# EAGLE design protoCuantumv2 (1) (EAGLE 9.6.2)
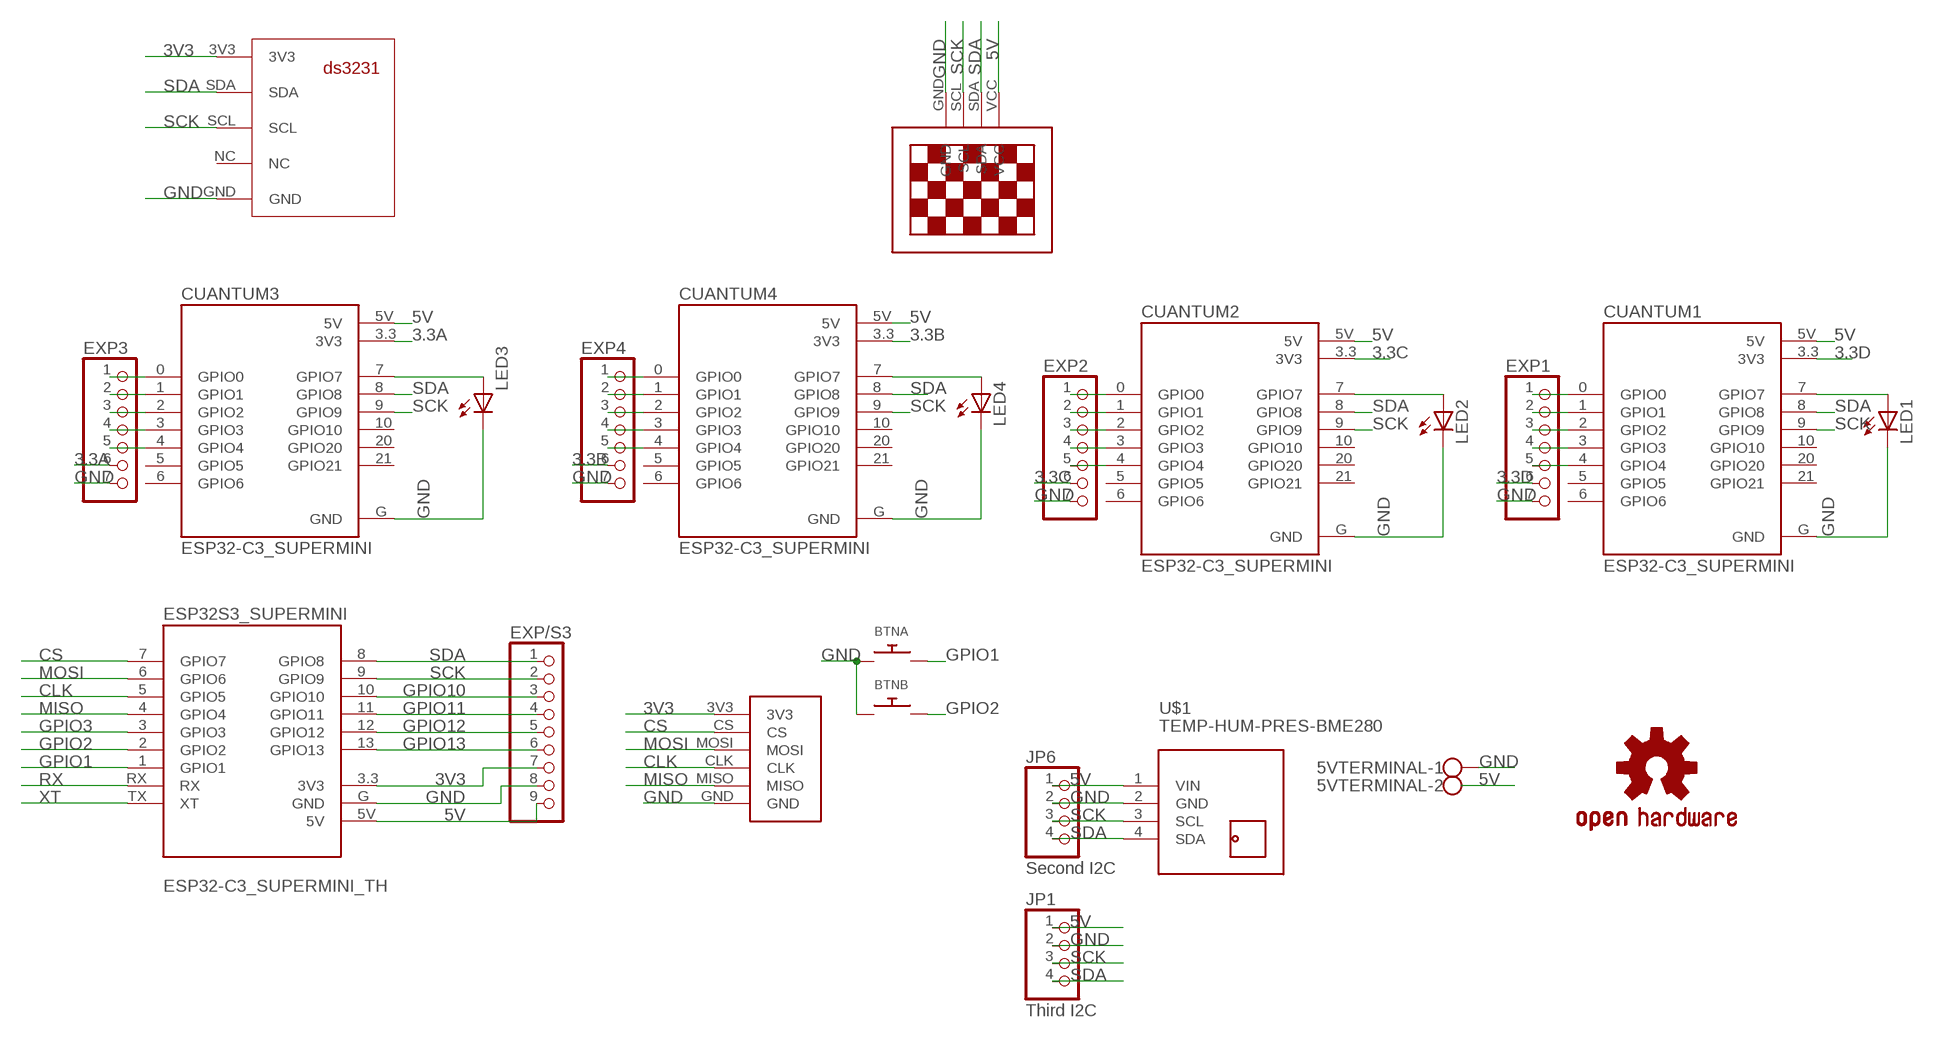
[diagram p0: schematic, sheet 1]

## Parts
5VTERMINAL  W237-102  [W237-102]
BTNA  SWITCH_PUSHBUTTONEVQ-PE  [TACT_PANA-EVQ]
BTNB  SWITCH_PUSHBUTTONEVQ-PE  [TACT_PANA-EVQ]
CUANTUM1  ESP32-C3_SUPERMINI  ESP32-C3_SUPERMINI_TH  [MODULE_ESP32-C3_SUPERMINI_TH]
CUANTUM2  ESP32-C3_SUPERMINI  ESP32-C3_SUPERMINI_TH  [MODULE_ESP32-C3_SUPERMINI_TH]
CUANTUM3  ESP32-C3_SUPERMINI  ESP32-C3_SUPERMINI_TH  [MODULE_ESP32-C3_SUPERMINI_TH]
CUANTUM4  ESP32-C3_SUPERMINI  ESP32-C3_SUPERMINI_TH  [MODULE_ESP32-C3_SUPERMINI_TH]
ESP32S3_SUPERMINI  ESP32-C3_SUPERMINI_TH  [MODULE_ESP32-C3_SUPERMINI_TH]
EXP1  PINHD-1X7  [1X07]
EXP2  PINHD-1X7  [1X07]
EXP3  PINHD-1X7  [1X07]
EXP4  PINHD-1X7  [1X07]
EXP/S3  PINHD-1X9  [1X09]
JP1  Third I2C  PINHD-1X4  [1X04]
JP6  Second I2C  PINHD-1X4  [1X04]
LED1  LED3MM  [LED3MM]
LED2  LED3MM  [LED3MM]
LED3  LED3MM  [LED3MM]
LED4  LED3MM  [LED3MM]
LOGO1  OSHW-LOGOM  [OSHW-LOGO-M]
OLED1.3  13"OLED13"OLED  [1.3"OLED]
U$1  TEMP-HUM-PRES-BME280  [TEMP-HUM-PRES-BME280]
U$2  SD_KUSKALLA  [SD_KUSKALLA]
U$4  RTC  [RTCDS3231FP]

## Nets
3.3A: CUANTUM3.3.3(3V3) EXP3.6
3.3B: CUANTUM4.3.3(3V3) EXP4.6
3.3C: CUANTUM2.3.3(3V3) EXP2.6
3.3D: CUANTUM1.3.3(3V3) EXP1.6
3V3: ESP32S3_SUPERMINI.3.3(3V3) EXP/S3.7 U$2.3V3 U$4.3V3
5V: 5VTERMINAL.2 CUANTUM1.5V CUANTUM2.5V CUANTUM3.5V CUANTUM4.5V ESP32S3_SUPERMINI.5V EXP/S3.9 JP1.1 JP6.1 OLED1.3.VCC U$1.1(VIN)
CLK: ESP32S3_SUPERMINI.5(GPIO5) U$2.CLK
CS: ESP32S3_SUPERMINI.7(GPIO7) U$2.CS
GND: 5VTERMINAL.1 BTNA.P$1 BTNB.P$1 CUANTUM1.G(GND) CUANTUM2.G(GND) CUANTUM3.G(GND) CUANTUM4.G(GND) ESP32S3_SUPERMINI.G(GND) EXP1.7 EXP2.7 EXP3.7 EXP4.7 EXP/S3.8 JP1.2 JP6.2 LED1.K(C) LED2.K(C) LED3.K(C) LED4.K(C) OLED1.3.GND U$1.2(GND) U$2.GND U$4.GND
GPIO1: BTNA.P$2 ESP32S3_SUPERMINI.1(GPIO1)
GPIO2: BTNB.P$2 ESP32S3_SUPERMINI.2(GPIO2)
GPIO3: ESP32S3_SUPERMINI.3(GPIO3)
GPIO10: ESP32S3_SUPERMINI.10(GPIO10) EXP/S3.3
GPIO11: ESP32S3_SUPERMINI.11(GPIO11) EXP/S3.4
GPIO12: ESP32S3_SUPERMINI.12(GPIO12) EXP/S3.5
GPIO13: ESP32S3_SUPERMINI.13(GPIO13) EXP/S3.6
MISO: ESP32S3_SUPERMINI.4(GPIO4) U$2.MISO
MOSI: ESP32S3_SUPERMINI.6(GPIO6) U$2.MOSI
N$1: CUANTUM4.7(GPIO7) LED4.A
N$2: CUANTUM4.0(GPIO0) EXP4.1
N$3: CUANTUM3.7(GPIO7) LED3.A
N$11: CUANTUM1.0(GPIO0) EXP1.1
N$12: CUANTUM1.1(GPIO1) EXP1.2
N$13: CUANTUM2.7(GPIO7) LED2.A
N$14: CUANTUM1.7(GPIO7) LED1.A
N$15: CUANTUM3.0(GPIO0) EXP3.1
N$16: CUANTUM3.1(GPIO1) EXP3.2
N$17: CUANTUM3.2(GPIO2) EXP3.3
N$18: CUANTUM3.3(GPIO3) EXP3.4
N$19: CUANTUM3.4(GPIO4) EXP3.5
N$20: CUANTUM4.1(GPIO1) EXP4.2
N$21: CUANTUM4.2(GPIO2) EXP4.3
N$22: CUANTUM4.3(GPIO3) EXP4.4
N$23: CUANTUM4.4(GPIO4) EXP4.5
N$24: CUANTUM2.0(GPIO0) EXP2.1
N$25: CUANTUM2.1(GPIO1) EXP2.2
N$26: CUANTUM2.2(GPIO2) EXP2.3
N$27: CUANTUM2.3(GPIO3) EXP2.4
N$28: CUANTUM2.4(GPIO4) EXP2.5
N$29: CUANTUM1.2(GPIO2) EXP1.3
N$30: CUANTUM1.3(GPIO3) EXP1.4
N$31: CUANTUM1.4(GPIO4) EXP1.5
RX: ESP32S3_SUPERMINI.RX
SCK: CUANTUM1.9(GPIO9) CUANTUM2.9(GPIO9) CUANTUM3.9(GPIO9) CUANTUM4.9(GPIO9) ESP32S3_SUPERMINI.9(GPIO9) EXP/S3.2 JP1.3 JP6.3 OLED1.3.SCL U$1.3(SCL) U$4.SCL
SDA: CUANTUM1.8(GPIO8) CUANTUM2.8(GPIO8) CUANTUM3.8(GPIO8) CUANTUM4.8(GPIO8) ESP32S3_SUPERMINI.8(GPIO8) EXP/S3.1 JP1.4 JP6.4 OLED1.3.SDA U$1.4(SDA) U$4.SDA
XT: ESP32S3_SUPERMINI.TX(XT)
Unconnected: CUANTUM1.5(GPIO5) CUANTUM1.6(GPIO6) CUANTUM1.10(GPIO10) CUANTUM1.20(GPIO20) CUANTUM1.21(GPIO21) CUANTUM2.5(GPIO5) CUANTUM2.6(GPIO6) CUANTUM2.10(GPIO10) CUANTUM2.20(GPIO20) CUANTUM2.21(GPIO21) CUANTUM3.5(GPIO5) CUANTUM3.6(GPIO6) CUANTUM3.10(GPIO10) CUANTUM3.20(GPIO20) CUANTUM3.21(GPIO21) CUANTUM4.5(GPIO5) CUANTUM4.6(GPIO6) CUANTUM4.10(GPIO10) CUANTUM4.20(GPIO20) CUANTUM4.21(GPIO21) U$4.NC

## Library data of the parts
5VTERMINAL = con-wago-500:W237-102: WAGO SCREW CLAMP; MPN: 237-102; OC_FARNELL: unknown; OC_NEWARK: 70K9898
BTNA BTNB = adafruit:SWITCH_PUSHBUTTON: Buttons SOFTTOUCHSMD_SJ - Soft touch temporary push button (Super Junk Akihabara) Compatible with SKPMANE010 [Mouser: 688-SKPMAN] C&K_KSS = Digikey: KSS221GLFS
CUANTUM1-CUANTUM4 = ESP32-C3_SUPERMINI_TH:ESP32-C3_SUPERMINI_TH: Check availability <https://pricing.snapeda.com/parts/ESP32-C3%20SuperMini_TH/Espressif%20Systems/view-part?ref=eda>; AVAILABILITY: Not in stock; CHECK_PRICES: https://www.snapeda.com/parts/ESP32-C3%20SuperMini_TH/Espressif+Systems/view-part/?ref=eda; DESCRIPTION: Super tiny ESP32-C3 board; MF: Espressif Systems; MP: ESP32-C3 SuperMini_TH; PACKAGE: Package; PRICE: None; SNAPEDA_LINK: https://www.snapeda.com/parts/ESP32-C3%20SuperMini_TH/Espressif+Systems/view-part/?ref=snap
ESP32S3_SUPERMINI = ESP32-S3_SUPERMINI_TH:ESP32-C3_SUPERMINI_TH: Biblioteca modificada para esp32 s3 super mini; AVAILABILITY: Not in stock; DESCRIPTION: Super tiny ESP32-S3; MARCA: model S3 esp32; MF: Espressif Systems; MODEL: esp32 S3; MP: ESP32-S3 SuperMini_TH; PACKAGE: Package
EXP1-EXP4 = pinhead:PINHD-1X7: PIN HEADER
EXP/S3 = pinhead:PINHD-1X9: PIN HEADER
JP1 JP6 = pinhead:PINHD-1X4: PIN HEADER
LED1-LED4 = adafruit:LED: LED OSRAM: - CHIPLED LG R971, LG N971, LY N971, LG Q971, LY Q971, LO R971, LY R971 LH N974, LH R974 LS Q976, LO Q976, LY Q976 LO Q996 - Hyper CHIPLED LW Q18S LB Q993, LB Q99A, LB R99A - SideLED LS A670, LO A670, LY A670, LG A670, LP A670 LB A673, LV A673, LT A673, LW A673 LH A674 LY A675 LS A676, LA A676, LO A676, LY A676, LW A676 LS A679, LY A679, LG A679 - Hyper Micro SIDELED® LS Y876, LA Y876, LO Y876, LY Y876 LT Y87S - SmartLED LW L88C, LW L88S LB L89C, LB L89S, LG L890 LS L89K, LO L89K, LY L89K LS L896, LA L896, LO L896, LY L896 - TOPLED LS T670, LO T670, LY T670, LG T670, LP T670 LSG T670, LSP T670, LSY T670, LOP T670, LYG T670 LG T671, LOG T671, LSG T671 LB T673, LV T673, LT T673, LW T673 LH T674 LS T676, LA T676, LO T676, LY T676, LB T676, LH T676, LSB T676, LW T676 LB T67C, LV T67C, LT T67C, LS T67K, LO T67K, LY T67K, LW E67C LS E67B, LA E67B, LO E67B, LY E67B, LB E67C, LV E67C, LT E67C LW T67C LS T679, LY T679, LG T679 LS T770, LO T770, LY T770, LG T770, LP T770 LB T773, LV T773, LT T773, LW T773 LH T774 LS E675, LA E675, LY E675, LS T675 LS T776, LA T776, LO T776, LY T776, LB T776 LHGB T686 LT T68C, LB T68C - Hyper Mini TOPLED® LB M676 - Mini TOPLED Santana® LG M470 LS M47K, LO M47K, LY M47K Source: http://www.osram.convergy.de/
LOGO1 = SparkFun-Aesthetics:OSHW-LOGO: Open-Source Hardware (OSHW) Logo This logo indicates the piece of hardware it is found on incorporates a OSHW license and/or adheres to the definition of open source hardware found here: http://freedomdefined.org/OSHW
OLED1.3 = 13oled:13"OLED
U$1 = diy-modules:TEMP-HUM-PRES-BME280: Digital Humidity-Temperature-Pressure Sensor based on BME280 device More information about BME280 device is available here: https://www.bosch-sensortec.com/bst/products/all_products/bme280 Click here to find device on ebay.com <http://www.ebay.com/sch/bme280+breakout>
U$2 = SD_KUSKALLA:SD_KUSKALLA
U$4 = rtc for pi ds3231:RTC

## Board
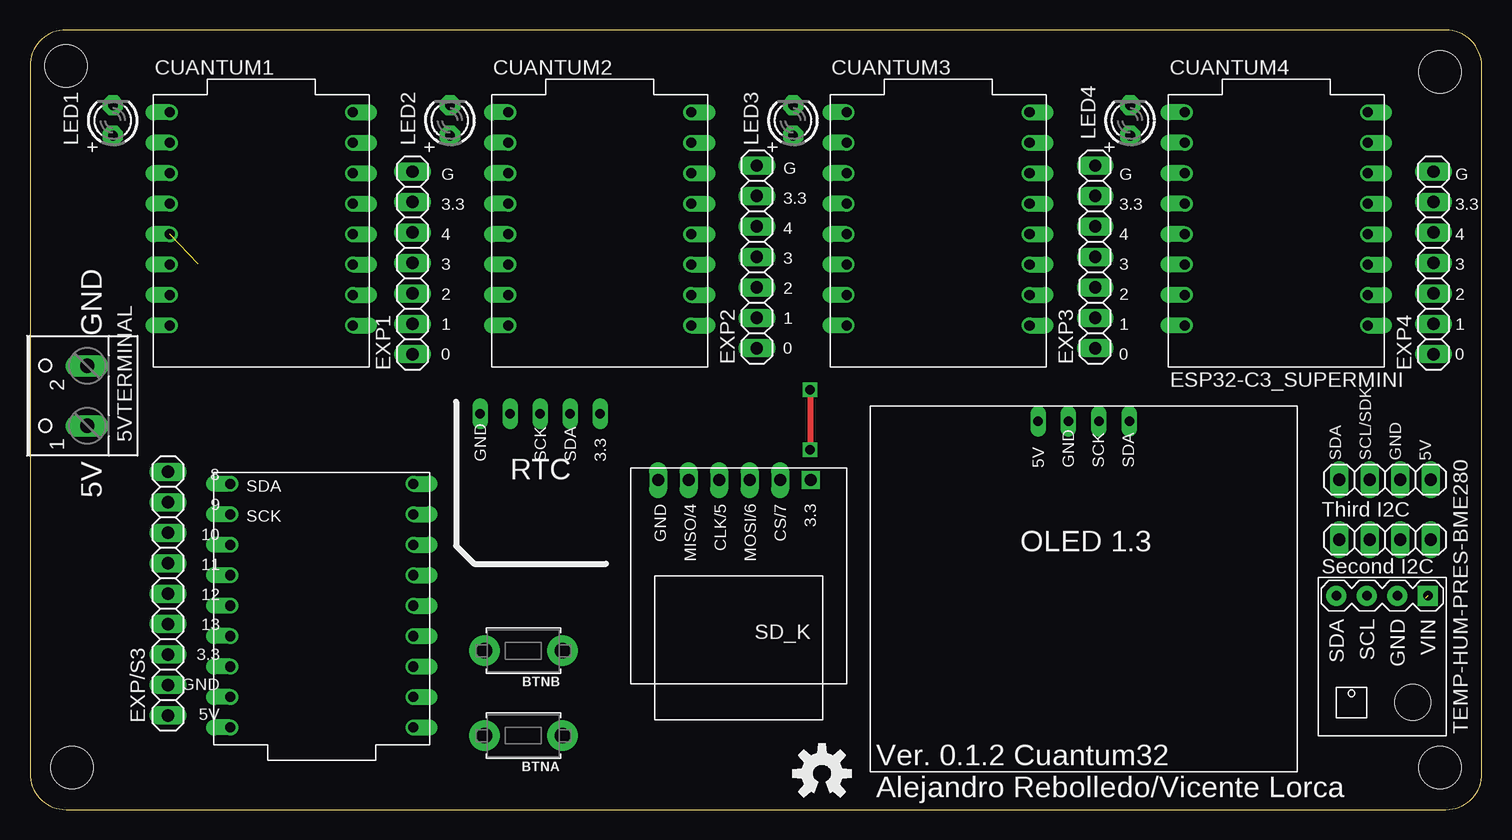
[diagram p1: board, top side]
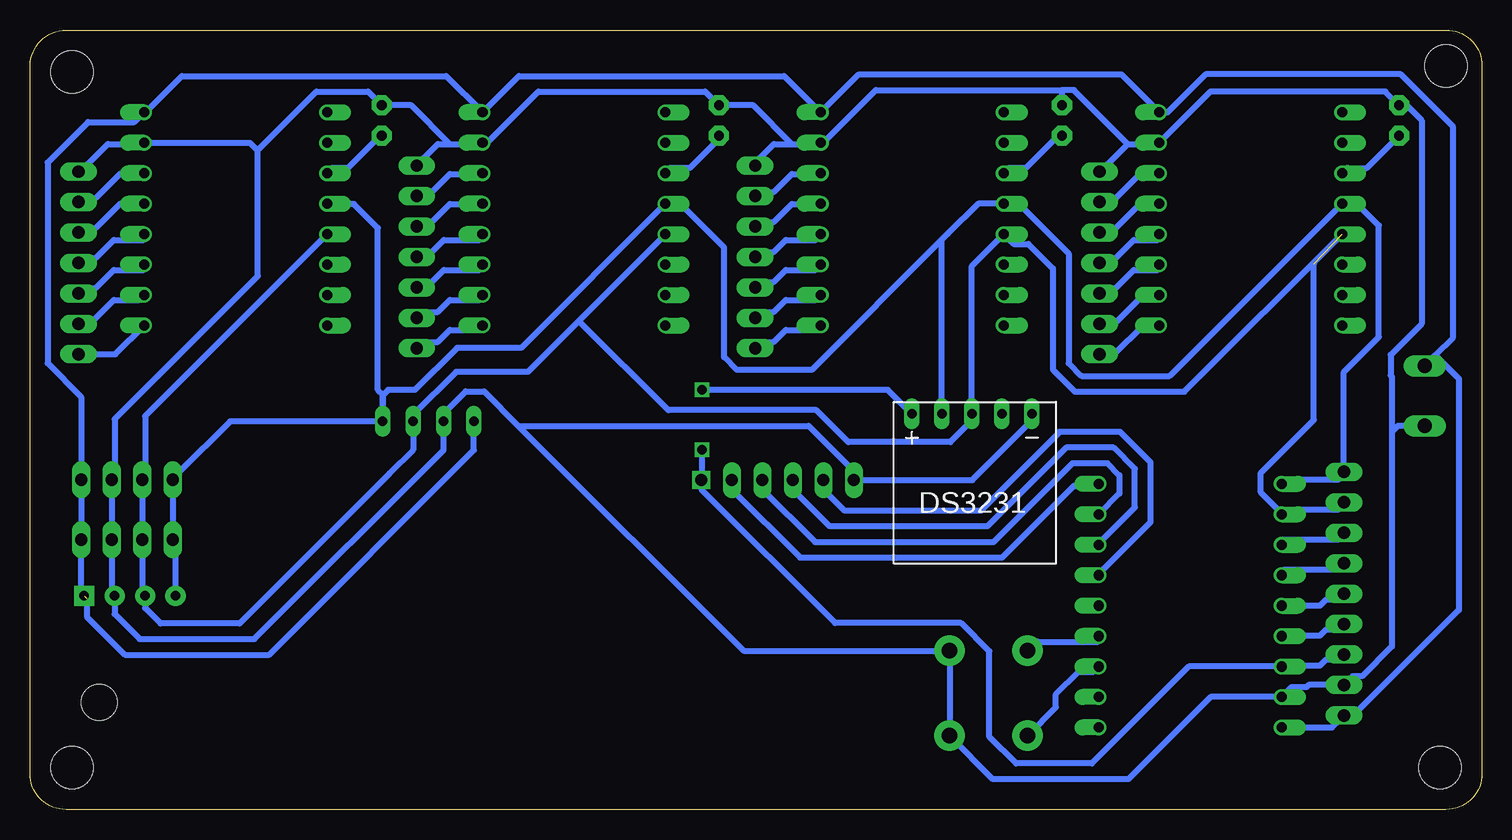
[diagram p2: board, bottom side, seen from below]

Size 121 x 65 mm. Coordinates in mm from the lower left corner, seen from the top.
Outline: 0,62 0,3 arc90 3,0 118,0 arc90 121,3 120.97,62 arc90 117.97,65 3,65 arc90 0,62
Copper layers (1*16): Top 0.035mm / dielectric 1.5mm / Bottom 0.035mm
Design rules "default *": minimum track width 0.5mm, minimum drill 0.8mm, track to track 0.8mm, track to pad 0.8mm, pad to pad 0.8mm, via to via 0.8mm, smd to smd 6mil, copper to edge 40mil, drill to drill 6mil, minimum pad ring 10mil, minimum via ring 8mil, stop-mask expansion 4mil, vias tented up to drill 0mil, thermal gap 10mil
Holes 3.5 mm at 3,62 3.5,3.5 117.5,3.5 117.5,61.5

### Footprints (pad centres in the part's own frame; a part is rotated, then mirrored left to right if it is on the bottom)
W237-102 = drill 1.194 long: 1 -2.5,-1.27; 2 2.5,-1.27
TACT_PANA-EVQ = drill 1.3 pad 2.54: P$1 -3.25,0; P$2 3.25,0
MODULE_ESP32-C3_SUPERMINI_TH = drill 0.84 offset: 0 7.62,-7.88; 1 7.62,-5.34; 2 7.62,-2.8; 3 7.62,-0.26; 3.3 7.62,4.82; 4 7.62,2.28; 5 -7.62,9.9; 5V 7.62,9.9; 6 -7.62,7.36; 7 -7.62,4.82; 8 -7.62,2.28; 9 -7.62,-0.26; 10 -7.62,-2.8; 20 -7.62,-5.34; 21 -7.62,-7.88; G 7.62,7.36
MODULE_ESP32-C3_SUPERMINI_TH' = drill 0.84 offset: 1 -7.62,4.82; 2 -7.62,2.28; 3 -7.62,-0.26; 3.3 7.62,4.82; 4 -7.62,-2.8; 5 -7.62,-5.34; 5V 7.62,9.9; 6 -7.62,-7.88; 7 -7.62,-10.42; 8 7.62,-10.42; 9 7.62,-7.88; 10 7.62,-5.34; 11 7.62,-2.8; 12 7.62,-0.26; 13 7.62,2.28; G 7.62,7.36; RX -7.62,7.36; TX -7.62,9.9
1X07 = drill 1.016 long: 1 -7.62,0; 2 -5.08,0; 3 -2.54,0; 4 0,0; 5 2.54,0; 6 5.08,0; 7 7.62,0
1X09 = drill 1.016 long: 1 -10.16,0; 2 -7.62,0; 3 -5.08,0; 4 -2.54,0; 5 0,0; 6 2.54,0; 7 5.08,0; 8 7.62,0; 9 10.16,0
1X04 = drill 1.016 long: 1 -3.81,0; 2 -1.27,0; 3 1.27,0; 4 3.81,0
LED3MM = drill 0.813 pad 1.676 octagon: A -1.27,0; K 1.27,0
1.3"OLED = drill 0.8 long: GND 2.54,0; SCL 5.08,0; SDA 7.62,0; VCC 0,0
TEMP-HUM-PRES-BME280 = drill 0.8 pad 1.676 square: 1 -5.08,3.81 | drill 0.8 pad 1.676: 2 -5.08,1.27; 3 -5.08,-1.27; 4 -5.08,-3.81 | hole 3: 3.81,2.54
SD_KUSKALLA = drill 1 square: 3V3 -8,6 | drill 1 long: CLK -8,-1.62; CS -8,3.46; GND -8,-6.7; MISO -8,-4.16; MOSI -8,0.92
RTCDS3231FP = drill 0.8 long: 3V3 1,12; GND 1,2; NC 1,4.5; SCL 1,7; SDA 1,9.5

### Placement (x,y rotation side)
5VTERMINAL  3.5,34.5 90 top
BTNA  41.12,6.16 180 top
BTNB  41.12,13.24 180 top
CUANTUM1  19.28,48.24 0 top
CUANTUM2  47.47,48.24 0 top
CUANTUM3  75.67,48.24 0 top
CUANTUM4  103.86,48.24 0 top
ESP32S3_SUPERMINI  ESP32-C3_SUPERMINI_TH  [MODULE_ESP32-C3_SUPERMINI_TH']  24.32,16.74 180 top
EXP1  31.88,45.58 90 top
EXP2  60.57,46.08 90 top
EXP3  88.77,46.08 90 top
EXP4  116.96,45.58 90 top
EXP/S3  11.5,18 270 top
JP1  112.92,27.5 180 top
JP6  112.92,22.5 180 top
LED1  6.91,57.45 90 top
LED2  35,57.45 90 top
LED3  63.59,57.45 90 top
LED4  91.68,57.45 90 top
LOGO1  66,3 0 top
OLED1.3  84,32.37 0 top
U$1  112.68,12.74 270 top
U$2  59.05,19.47 270 top
U$4  35.5,34 270 top

### Tracks (layer width: path | path; a pad name or v marks a point on that pad's centre or on a via)
3.3A
  Bottom 0.5: CUANTUM3.3.3 83.5,53 86,53 87.5,51.5 88.5,51.5 EXP3.6
3.3B
  Bottom 0.5: CUANTUM4.3.3 111.5,53 113.5,53 115.5,51 116.5,51 EXP4.6
3.3C
  Bottom 0.5: CUANTUM2.3.3 55.5,53 57.5,53 59,51.5 60.5,51.5 EXP2.6
3.3D
  Bottom 0.5: CUANTUM1.3.3 27,53 28.5,53 30.5,51 31.5,51 EXP1.6
3V3  (via drill 0.8, 0.8 pad 1.05)
  Top 0.5: v65,35 v65,30
  Bottom 0.5: EXP/S3.7 11.5,12.5 13,12.5 13.5,12 16.5,12 ESP32S3_SUPERMINI.3.3 24.42,11.92 32.5,3.84 38.83,3.84 41.05,6.06 41.05,13.2 43.41,15.56 53.91,15.56 65.05,26.7 U$2.3V3 65,27.47 v65,30 | v65,35 49.5,35 U$4.3V3
5V  (1 unrouted)
  Bottom 0.5: ESP32S3_SUPERMINI.5V 12.5,6.84 11.67,7.67 | 11.67,7.67 EXP/S3.9 | 116.25,17.58 116.25,16.07 113.1,12.92 101.06,12.92 84,29.98 OLED1.3.VCC | 3.88,37.88 2.4,39.37 2.4,56.94 6.76,61.3 23.04,61.3 26.2,58.14 CUANTUM1.5V 30.06,61.3 51.93,61.3 CUANTUM2.5V 55.14,58.14 58.16,61.16 80.27,61.16 CUANTUM3.5V 86.31,61.16 108.34,61.16 111.36,58.14 CUANTUM4.5V 112.3,57.32 116.16,57.32 119.53,53.95 119.53,37.21 116.73,34.41 JP1.1 JP6.1 116.73,18.06 U$1.1 | 3.88,37.88 5VTERMINAL.2 | 3.88,37.88 1.93,35.93 1.93,16.63 10.88,7.67 11.67,7.67
CLK
  Bottom 0.5: ESP32S3_SUPERMINI.5 31.94,22.18 28.92,25.21 28.92,28.41 30.69,30.18 34.65,30.18 41.23,23.61 54.34,23.61 57.43,26.7 U$2.CLK
CS
  Bottom 0.5: ESP32S3_SUPERMINI.7 32.1,27 34,27 39.99,21.01 56.82,21.01 62.51,26.7 U$2.CS
GND
  Bottom 0.5: 29.5,55.5 27,55.5 CUANTUM1.G 22.64,59.86 8.05,59.86 LED1.K 6.28,58.72 5.02,57.47 5.02,40.5 7.61,37.91 7.61,36.19 7.5,36.08 7.5,31.5 | 29.5,55.5 31.5,53.5 EXP1.7 | 35,60 34,60 29.5,55.5 | 57.5,55.5 59,55.5 60.5,54 EXP2.7 | 57.5,55.5 55.5,55.5 CUANTUM2.G 55,55.5 50.5,60 35,60 | 86,55.5 87,55.5 88.5,54 EXP3.7 | 86,55.5 83.5,55.5 CUANTUM3.G 82.9,55.6 78.64,59.86 64.73,59.86 LED3.K 60.72,58.72 57.5,55.5 | 102,55 102,44.5 113.95,32.55 113.95,27.74 JP1.2 JP6.2 114.19,18.06 U$1.2 113.95,16.31 111.86,14.22 102.3,14.22 86.54,29.98 OLED1.3.GND 86.54,33.03 84.71,34.87 83.16,34.87 80.3,32 | 35,60 LED2.K | 86,55.5 89.22,58.72 LED4.K 92.82,59.86 97.14,59.86 102,55 | 102,55 102.04,54.96 102.68,55.6 CUANTUM4.G 111.5,55.5 114.5,55.5 116.8,53.2 EXP4.7 | 80.3,32 56.12,32 52.35,28.23 U$2.GND 42.47,27.47 37.5,32.44 U$4.GND | 80.3,32 61.54,13.24 BTNB.P$1 BTNA.P$1 40.75,2.54 29.46,2.54 22.62,9.38 ESP32S3_SUPERMINI.G 15.88,10.2 14.64,10.2 14.45,10.38 EXP/S3.8 10.77,11.11 9.99,11.11 7.5,13.6 7.5,31.5 | 5VTERMINAL.1 7,32 7.5,31.5
GPIO1
  Bottom 0.5: ESP32S3_SUPERMINI.1 32.36,11.5 33.61,11.5 35.5,9.61 35.5,8.53 BTNA.P$2
GPIO2
  Bottom 0.5: ESP32S3_SUPERMINI.2 32,14 37,14 37.5,13.5 BTNB.P$2
GPIO10
  Bottom 0.5: ESP32S3_SUPERMINI.10 16.5,22.5 12,22.5 11.5,23 EXP/S3.3
GPIO11
  Bottom 0.5: ESP32S3_SUPERMINI.11 16.5,20 12,20 11.5,20.5 EXP/S3.4
GPIO12
  Bottom 0.5: ESP32S3_SUPERMINI.12 13.5,17 13,17.5 12,17.5 EXP/S3.5
GPIO13
  Bottom 0.5: ESP32S3_SUPERMINI.13 16.5,14.5 13.5,14.5 13,15 11.5,15 EXP/S3.6
MISO
  Bottom 0.5: ESP32S3_SUPERMINI.4 31.94,19.64 27.62,23.97 27.62,28.95 30.15,31.48 35.19,31.48 41.77,24.91 53.1,24.91 54.89,26.7 U$2.MISO
MOSI
  Bottom 0.5: ESP32S3_SUPERMINI.6 30.22,26.34 30.22,27.87 31.23,28.88 34.12,28.88 40.69,22.31 55.58,22.31 59.97,26.7 U$2.MOSI
N$1
  Bottom 0.5: LED4.A 91.82,56.18 94.5,53.5 95.8,53.5 CUANTUM4.7
N$2
  Bottom 0.5: EXP4.1 113.88,37.96 CUANTUM4.0
N$3
  Bottom 0.5: LED3.A 63.59,55.91 66,53.5 67.61,53.5 CUANTUM3.7
N$11
  Bottom 0.5: CUANTUM1.0 28.25,40.36 30.65,37.96 EXP1.1
N$12
  Bottom 0.5: CUANTUM1.1 28.25,42.9 30.65,40.5 EXP1.2
N$13
  Bottom 0.5: CUANTUM2.7 39.41,53.5 38,53.5 35.32,56.18 LED2.A
N$14
  Bottom 0.5: CUANTUM1.7 11.22,53.5 9.59,53.5 LED1.A
N$15
  Bottom 0.5: CUANTUM3.0 83.5,40 86,40 87,39 88,39 88.5,38.5 EXP3.1
N$16
  Bottom 0.5: CUANTUM3.1 83.5,42.5 86,42.5 87,41.5 88,41.5 88.5,41 EXP3.2
N$17
  Bottom 0.5: CUANTUM3.2 83.5,45 86.5,45 87.5,44 88.5,44 EXP3.3
N$18
  Bottom 0.5: CUANTUM3.3 83.5,47.5 86.5,47.5 87.5,46.5 88.5,46.5 EXP3.4
N$19
  Bottom 0.5: CUANTUM3.4 83.5,50.5 86,50.5 87.5,49 88.5,49 EXP3.5
N$20
  Bottom 0.5: EXP4.2 116,40.5 114,42.5 111.88,42.5 CUANTUM4.1
N$21
  Bottom 0.5: CUANTUM4.2 111.5,45 114,45 115.5,43.5 116.5,43.5 EXP4.3
N$22
  Bottom 0.5: CUANTUM4.3 111.5,47.5 114,47.5 115.5,46 116.5,46 EXP4.4
N$23
  Bottom 0.5: CUANTUM4.4 111.5,50.5 113.5,50.5 115.5,48.5 116.5,48.5 EXP4.5
N$24
  Bottom 0.5: CUANTUM2.0 55.5,40 58,40 59,39 60,39 60.5,38.5 EXP2.1
N$25
  Bottom 0.5: CUANTUM2.1 55.5,42.5 58,42.5 59,41.5 60,41.5 60.5,41 EXP2.2
N$26
  Bottom 0.5: CUANTUM2.2 55.5,45 58,45 59,44 60.5,44 EXP2.3
N$27
  Bottom 0.5: CUANTUM2.3 55.5,47.5 58,47.5 59,46.5 60.5,46.5 EXP2.4
N$28
  Bottom 0.5: CUANTUM2.4 55.5,50.5 57.5,50.5 59,49 60.5,49 EXP2.5
N$29
  Bottom 0.5: CUANTUM1.2 27,45 29,45 30.5,43.5 31.5,43.5 EXP1.3
N$30
  Bottom 0.5: CUANTUM1.3 27,47.5 29,47.5 30.5,46 31.5,46 EXP1.4
N$31
  Bottom 0.5: CUANTUM1.4 27,50.5 28.5,50.5 30.5,48.5 31.5,48.5 EXP1.5
SCK  (1 unrouted)
  Bottom 0.5: EXP/S3.2 11.5,25.5 12,25 16.5,25 ESP32S3_SUPERMINI.9 16.7,24.7 18.42,26.42 18.42,28.08 14,32.5 14,45.5 | 75.25,40.75 68.5,47.5 CUANTUM3.9 | 75.25,40.75 79.5,36.5 85.48,36.5 89,32.98 89,32.45 OLED1.3.SCL 89.08,30 91.03,28.05 91.03,28.03 103.54,15.52 110.12,15.52 111.41,16.81 U$1.3 111.65,18.06 JP6.3 JP1.3 111.41,27.74 111.41,32.81 CUANTUM4.9 | CUANTUM1.9 24.79,34.85 33.93,34.85 35.75,36.67 35.75,45.12 37.79,47.16 39.04,47.16 CUANTUM2.9 42.5,45.33 U$4.SCL 42.5,32.44 44.29,30.64 52.8,30.64 55.46,33.3 67.8,33.3 75.25,40.75
SDA
  Bottom 0.5: ESP32S3_SUPERMINI.8 16.5,27.5 12,27.5 11.5,28 EXP/S3.1 11.5,36.5 8.59,39.41 8.59,48.69 10.39,50.5 11.64,50.5 CUANTUM1.8 26.03,36.15 33.39,36.15 34.45,37.21 34.45,46.36 38.61,50.52 CUANTUM2.8 42,50.52 44.51,48.01 45,47.52 | CUANTUM4.8 96,50.5 94,50.5 92,48.5 92,35 91.62,34.62 OLED1.3.SDA | 45,47.52 55.87,36.65 62.08,36.65 63.15,37.71 63.15,46.86 66.8,50.52 CUANTUM3.8 80.07,38.5 85.4,38.5 88.92,34.98 91.16,34.98 91.62,34.52 OLED1.3.SDA | U$4.SDA 45,47.52 | OLED1.3.SDA 104.32,32.37 108.59,28.09 108.59,28.02 JP1.4 JP6.4 108.87,22.26 U$1.4

### Text on the board
tNames: GND | G / 3.3 / 4 / 3 / 2 / 1 / 0 | G / 3.3 / 4 / 3 / 2 / 1 / 0 | G / 3.3 / 4 / 3 / 2 / 1 / 0 | G / 3.3 / 4 / 3 / 2 / 1 / 0 | GND / / SCK / SDA / 3.3 | SDA / SCL/SDK / GND / 5V | 8 / 9 / 10 / 11 / 12 / 13 / 3.3 / GND / 5V | RTC | 5V / GND / SCK / SDA | 5V | GND / MISO/4 / CLK/5 / MOSI/6 / CS/7 / 3.3 | SDA / SCK | OLED 1.3 | Ver. 0.1.2 Cuantum32 / Alejandro Rebolledo/Vicente Lorca